# EAGLE schematic base (EAGLE 7.3.0)
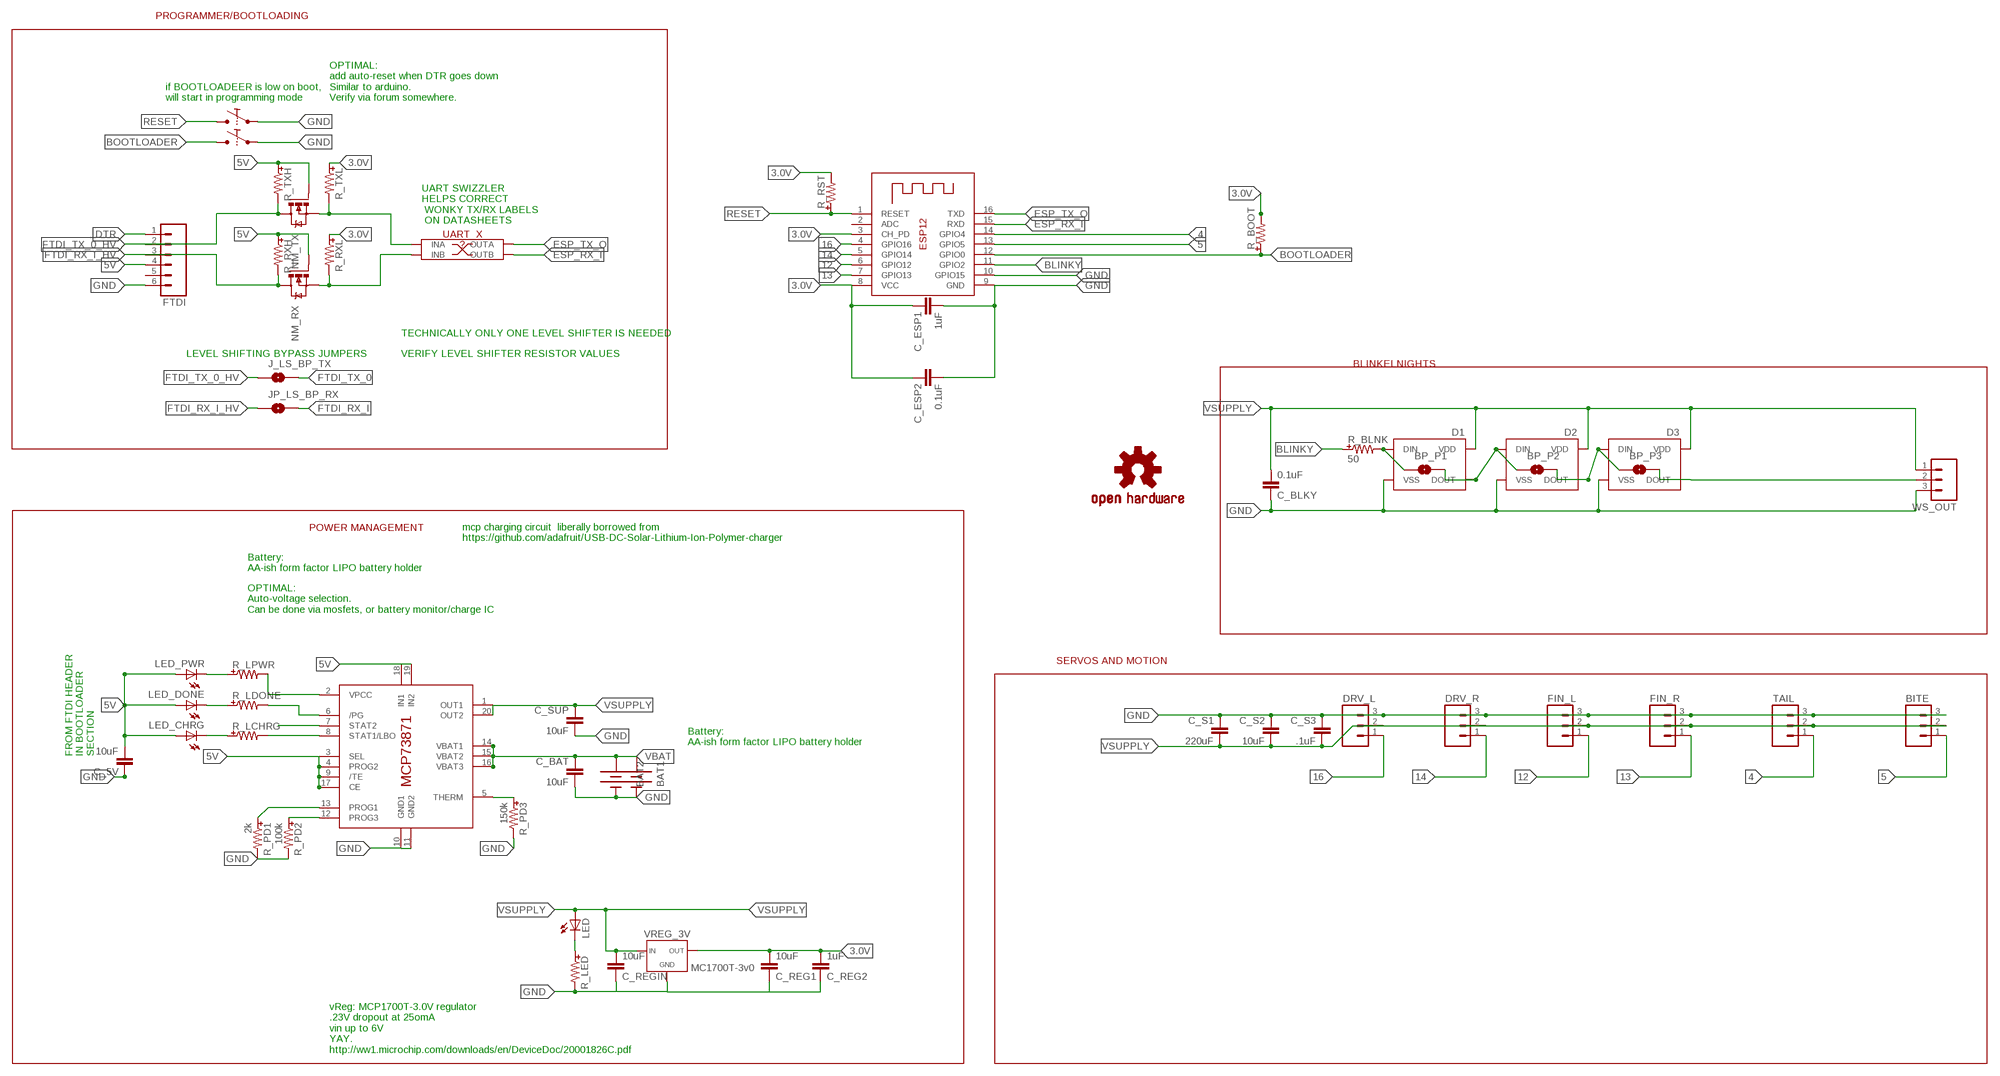
[diagram p0: schematic, sheet 1]

## Parts
BAT1  BATTERY18650  [BATTERY_18650-HOLDER]
BAT2  BATTERYAA  [BATTERY-AA]
BITE  M03LOCK  [1X03_LOCK]
BP_P1  JUMPER-PAD-2-NOYES_SILK  [PAD-JUMPER-2-NO_YES_SILK]
BP_P2  JUMPER-PAD-2-NOYES_SILK  [PAD-JUMPER-2-NO_YES_SILK]
BP_P3  JUMPER-PAD-2-NOYES_SILK  [PAD-JUMPER-2-NO_YES_SILK]
BTN_PROG  BUTTONPJRC  [BUTTON-PJRC]
BTN_RST  BUTTONPJRC  [BUTTON-PJRC]
C_5V  10uF  CAPUNIVERSAL  [0402-0603-0805-UNIVERSAL]
C_BAT  10uF  CAPUNIVERSAL  [0402-0603-0805-UNIVERSAL]
C_BLKY  0.1uF  CAPUNIVERSAL  [0402-0603-0805-UNIVERSAL]
C_ESP1  1uF  CAPUNIVERSAL  [0402-0603-0805-UNIVERSAL]
C_ESP2  0.1uF  CAPUNIVERSAL  [0402-0603-0805-UNIVERSAL]
C_REG1  10uF  CAPUNIVERSAL  [0402-0603-0805-UNIVERSAL]
C_REG2  1uF  CAPUNIVERSAL  [0402-0603-0805-UNIVERSAL]
C_REGIN  10uF  CAPUNIVERSAL  [0402-0603-0805-UNIVERSAL]
C_S1  220uF  CAPUNIVERSAL  [0402-0603-0805-UNIVERSAL]
C_S2  10uF  CAPUNIVERSAL  [0402-0603-0805-UNIVERSAL]
C_S3  .1uF  CAPUNIVERSAL  [0402-0603-0805-UNIVERSAL]
C_SUP  10uF  CAPUNIVERSAL  [0402-0603-0805-UNIVERSAL]
D1  WS2812B  [WS2812B]
D2  WS2812B  [WS2812B]
D3  WS2812B  [WS2812B]
DRV_L  M03LOCK  [1X03_LOCK]
DRV_R  M03LOCK  [1X03_LOCK]
FIN_L  M03LOCK  [1X03_LOCK]
FIN_R  M03LOCK  [1X03_LOCK]
FTDI  M06LOCK  [1X06_LOCK]
IC_LIPO  MCP73871  [QFN20]
J_LS_BP_TX  JUMPER-PAD-2-NOYES_SILK  [PAD-JUMPER-2-NO_YES_SILK]
JP_LS_BP_RX  JUMPER-PAD-2-NOYES_SILK  [PAD-JUMPER-2-NO_YES_SILK]
LED  LEDUNIVERSAL  [0402-0603-0805-UNIVERSAL]
LED_CHRG  LEDUNIVERSAL  [0402-0603-0805-UNIVERSAL]
LED_DONE  LEDUNIVERSAL  [0402-0603-0805-UNIVERSAL]
LED_PWR  LEDUNIVERSAL  [0402-0603-0805-UNIVERSAL]
LOGO1  OSHW-LOGOS  [OSHW-LOGO-S]
NM_RX  MOSFET-NCHANNELSMD  [SOT23-3]
NM_TX  MOSFET-NCHANNELSMD  [SOT23-3]
R_BLNK  50  RESISTORUNIVERSAL  [0402-0603-0805-UNIVERSAL]
R_BOOT  RESISTORUNIVERSAL  [0402-0603-0805-UNIVERSAL]
R_LCHRG  RESISTORUNIVERSAL  [0402-0603-0805-UNIVERSAL]
R_LDONE  RESISTORUNIVERSAL  [0402-0603-0805-UNIVERSAL]
R_LED  RESISTORUNIVERSAL  [0402-0603-0805-UNIVERSAL]
R_LPWR  RESISTORUNIVERSAL  [0402-0603-0805-UNIVERSAL]
R_PD1  2k  RESISTORUNIVERSAL  [0402-0603-0805-UNIVERSAL]
R_PD2  100k  RESISTORUNIVERSAL  [0402-0603-0805-UNIVERSAL]
R_PD3  150k  RESISTORUNIVERSAL  [0402-0603-0805-UNIVERSAL]
R_RST  RESISTORUNIVERSAL  [0402-0603-0805-UNIVERSAL]
R_RXH  RESISTORUNIVERSAL  [0402-0603-0805-UNIVERSAL]
R_RXL  RESISTORUNIVERSAL  [0402-0603-0805-UNIVERSAL]
R_TXH  RESISTORUNIVERSAL  [0402-0603-0805-UNIVERSAL]
R_TXL  RESISTORUNIVERSAL  [0402-0603-0805-UNIVERSAL]
TAIL  M03LOCK  [1X03_LOCK]
UART_X  UART_SWITCHER0603  [UART_SWITCHER_0603]
VREG_3V  MC1700T-3v0  VOLTAGE-REGULATORMCP1703  [SOT23]
WS_OUT  M03LOCK  [1X03_LOCK]
X1  ESP-12  [ESP-12]

## Nets
3.0V: C_ESP1.- C_ESP2.- C_REG1.+ C_REG2.+ R_BOOT.- R_RST.- R_RXL.+ R_TXL.+ VREG_3V.2(OUT) X1.3(CH_PD) X1.8(VCC)
4: TAIL.1 X1.14(GPIO4)
5: BITE.1 X1.13(GPIO5)
5V: C_5V.+ FTDI.4 IC_LIPO.3(SEL) IC_LIPO.4(PROG2) IC_LIPO.9(/TE) IC_LIPO.17(CE) IC_LIPO.18(IN1) IC_LIPO.19(IN2) LED_CHRG.+(A) LED_DONE.+(A) LED_PWR.+(A) NM_RX.1(G) NM_TX.1(G) R_RXH.+ R_TXH.+
12: FIN_L.1 X1.6(GPIO12)
13: FIN_R.1 X1.7(GPIO13)
14: DRV_R.1 X1.5(GPIO14)
16: DRV_L.1 X1.4(GPIO16)
BLINKY: R_BLNK.+ X1.11(GPIO2)
BOOTLOADER: BTN_PROG.A1 BTN_PROG.A2 R_BOOT.+ X1.12(GPIO0)
DTR: FTDI.1
ESP_RX_I: UART_X.TX_B(OUTB) X1.15(RXD)
ESP_TX_O: UART_X.RX_B(OUTA) X1.16(TXD)
FTDI_RX_I: JP_LS_BP_RX.2 NM_RX.2(S) R_RXL.- UART_X.RX_A(INB)
FTDI_RX_I_HV: FTDI.3 JP_LS_BP_RX.1 NM_RX.3(D) R_RXH.-
FTDI_TX_0: J_LS_BP_TX.2 NM_TX.2(S) R_TXL.- UART_X.TX_A(INA)
FTDI_TX_0_HV: FTDI.2 J_LS_BP_TX.1 NM_TX.3(D) R_TXH.-
GND: BAT1.GND@1(-) BAT2.GND@1(-) BITE.3 BTN_PROG.B1 BTN_PROG.B2 BTN_RST.B1 BTN_RST.B2 C_5V.- C_BAT.+ C_BLKY.- C_ESP1.+ C_ESP2.+ C_REG1.- C_REG2.- C_REGIN.- C_S1.- C_S2.- C_S3.- C_SUP.+ D1.3(VSS) D2.3(VSS) D3.3(VSS) DRV_L.3 DRV_R.3 FIN_L.3 FIN_R.3 FTDI.6 IC_LIPO.10(GND1) IC_LIPO.11(GND2) R_LED.- R_PD1.- R_PD2.- R_PD3.- TAIL.3 VREG_3V.1(GND) WS_OUT.3 X1.9(GND) X1.10(GPIO15)
N$1: IC_LIPO.8(STAT1/LBO) R_LCHRG.-
N$3: BP_P1.2 BP_P2.1 D1.2(DOUT) D2.4(DIN)
N$4: IC_LIPO.5(THERM) R_PD3.+
N$5: LED_CHRG.-(C) R_LCHRG.+
N$6: LED.-(C) R_LED.+
N$7: LED_DONE.-(C) R_LDONE.+
N$8: LED_PWR.-(C) R_LPWR.+
N$9: IC_LIPO.2(VPCC) R_LPWR.-
N$10: BP_P1.1 D1.4(DIN) R_BLNK.-
N$11: BP_P2.2 BP_P3.1 D2.2(DOUT) D3.4(DIN)
N$12: BP_P3.2 D3.2(DOUT) WS_OUT.2
N$20: IC_LIPO.7(STAT2)
N$21: IC_LIPO.6(/PG) R_LDONE.-
N$22: IC_LIPO.12(PROG3) R_PD2.+
N$23: IC_LIPO.13(PROG1) R_PD1.+
RESET: BTN_RST.A1 BTN_RST.A2 R_RST.+ X1.1(RESET)
VBAT: BAT1.PWR@1(+) BAT2.PWR@1(+) C_BAT.- IC_LIPO.14(VBAT1) IC_LIPO.15(VBAT2) IC_LIPO.16(VBAT3)
VSUPPLY: BITE.2 C_BLKY.+ C_REGIN.+ C_S1.+ C_S2.+ C_S3.+ C_SUP.- D1.1(VDD) D2.1(VDD) D3.1(VDD) DRV_L.2 DRV_R.2 FIN_L.2 FIN_R.2 IC_LIPO.1(OUT1) IC_LIPO.20(OUT2) LED.+(A) TAIL.2 VREG_3V.3(IN) WS_OUT.1
Unconnected: FTDI.5 X1.2(ADC)

## Notes on the sheet
- PROGRAMMER/BOOTLOADING
- if BOOTLOADEER is low on boot, 
  will start in programming mode
- OPTIMAL: 
  add auto-reset when DTR goes down
  Similar to arduino. 
  Verify via forum somewhere.
- UART SWIZZLER
  HELPS CORRECT
   WONKY TX/RX LABELS
   ON DATASHEETS
- TECHNICALLY ONLY ONE LEVEL SHIFTER IS NEEDED
- LEVEL SHIFTING BYPASS JUMPERS | VERIFY LEVEL SHIFTER RESISTOR VALUES
- BLINKELNIGHTS
- POWER MANAGEMENT
- mcp charging circuit  liberally borrowed from 
  https://github.com/adafruit/USB-DC-Solar-Lithium-Ion-Polymer-charger
- Battery: 
  AA-ish form factor LIPO battery holder
- OPTIMAL: 
  Auto-voltage selection. 
  Can be done via mosfets, or battery monitor/charge IC
- SERVOS AND MOTION
- FROM FTDI HEADER
  IN BOOTLOADER 
  SECTION
- Battery: 
  AA-ish form factor LIPO battery holder
- vReg: MCP1700T-3.0V regulator
  .23V dropout at 25omA
  vin up to 6V 
  YAY.
  http://ww1.microchip.com/downloads/en/DeviceDoc/20001826C.pdf

## Library data of the parts
BAT1 BAT2 = SparkFun-Electromechanical:BATTERY: Battery Holders Various common sizes : AA, AAA, 18650 (PRT-12895), 20mm coin cell and 12mm coin cell. 20MM_4LEGS, BATT-10373
BITE DRV_L DRV_R FIN_L FIN_R TAIL WS_OUT = SparkFun-Connectors:M03: Header 3 Standard 3-pin 0.1" header. Use with straight break away headers (SKU : PRT-00116), right angle break away headers (PRT-00553), swiss pins (PRT-00743), machine pins (PRT-00117), and female headers (PRT-00115). Molex polarized connector foot print use with SKU : PRT-08232 with associated crimp pins and housings.
BP_P1-BP_P3 J_LS_BP_TX JP_LS_BP_RX = SparkFun-Passives:JUMPER-PAD-2-NO
BTN_PROG BTN_RST = tekdemo:BUTTON
C_5V C_BAT C_BLKY C_ESP1 C_ESP2 C_REG1 C_REG2 C_REGIN C_S1-C_S3 C_SUP = tekdemo:CAP: Capacitor Standard 0603 ceramic capacitor, and 0.1" leaded capacitor.
D1-D3 = tekdemo:WS2812B: WS2812B - Intelligent control LED integrated light source Technical Specifications: Power Supply Voltage (VDD): 3.5 to 5.3 V Input Voltage (VI): -0.5 to VDD+0.5 V Operating Junction Temperature (Topt): -25°C to +80°C Storage Temperature Range (Tstg): -55°C to +150°C
FTDI = SparkFun-Connectors:M06: Header 6 Standard 6-pin 0.1" header. Use with straight break away headers (SKU : PRT-00116), right angle break away headers (PRT-00553), swiss pins (PRT-00743), machine pins (PRT-00117), and female headers (PRT-00115). Molex polarized connector foot print use with SKU : PRT-08094 with associated crimp pins and housings. NOTES ON THE VARIANTS LOCK and LOCK_LONGPADS... This footprint was designed to help hold the alignment of a through-hole component (i.e. 6-pin header) while soldering it into place. You may notice that each hole has been shifted either up or down by 0.005 of an inch from it's more standard position (which is a perfectly straight line). This slight alteration caused the pins (the squares in the middle) to touch the edges of the holes. Because they are alternating, it causes a "brace" to hold the component in place. 0.005 has proven to be the perfect amount of "off-center" position when using our standard breakaway headers. Although looks a little odd when you look at the bare footprint, once you have a header in there, the alteration is very hard to notice. Also,if you push a header all the way into place, it is covered up entirely on the bottom side. This idea of altering the position of holes to aid alignment will be further integrated into the Sparkfun Library for other footprints. It can help hold any component with 3 or more connection pins.
IC_LIPO = adafruit:MCP73871
LED LED_CHRG LED_DONE LED_PWR = tekdemo:LED: LEDs Standard schematic elements and footprints for 5mm, 3mm, 1206, and 0603 sized LEDs. 5mm - Spark Fun Electronics SKU : Comp-SBL
LOGO1 = tekdemo:OSHW-LOGO: Open Source Hardware Logo This logo indicates the piece of hardware it is found on incorporates a OSHW license and/or adheres to the definition of open source hardware found here: http://freedomdefined.org/OSHW
NM_RX NM_TX = tekdemo:MOSFET-NCHANNEL: Generic NMOS footprint
R_BLNK R_BOOT R_LCHRG R_LDONE R_LED R_LPWR R_PD1-R_PD3 R_RST R_RXH R_RXL R_TXH R_TXL = tekdemo:RESISTOR: Resistor Basic schematic elements and footprints for 0603, 1206, and PTH resistors.
UART_X = tekdemo:UART_SWITCHER
VREG_3V = tekdemo:VOLTAGE-REGULATOR
X1 = adafruit:ESP-12